# Altium schematic sheet ST Sensor Output Socket.SchDoc: Soil Temperature Sensor Output Socket
size A4; SheetNumber: 31; SheetTotal: 37
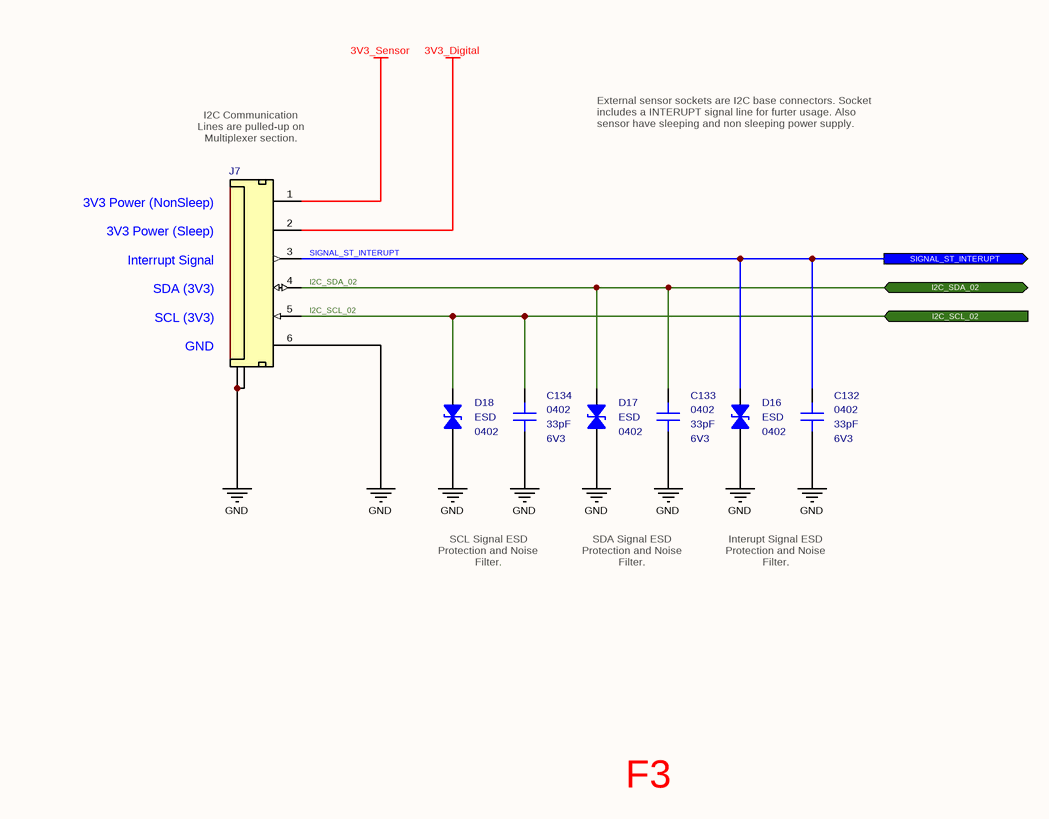
[diagram p0: ST Sensor Output Socket.SchDoc]

## Parts
C132  value 33pF  Case: 0402  Voltage: 6V3  [CAPACITOR_0402]  (hidden comment: Multilayer Ceramic Capacitor)
C133  value 33pF  Case: 0402  Voltage: 6V3  [CAPACITOR_0402]  (hidden comment: Multilayer Ceramic Capacitor)
C134  value 33pF  Case: 0402  Voltage: 6V3  [CAPACITOR_0402]  (hidden comment: Multilayer Ceramic Capacitor)
D16  Case: 0402  [ESD_0402]  (hidden comment: ESD Suppressors)
D17  Case: 0402  [ESD_0402]  (hidden comment: ESD Suppressors)
D18  Case: 0402  [ESD_0402]  (hidden comment: ESD Suppressors)
J7  ST Sensor Socket  [Connector_Tunic 6P - H]  (value not drawn)

## Ports
I2C_SCL_02 (in), I2C_SDA_02 (bidir), SIGNAL_ST_INTERUPT (out)

## Nets
3V3_Digital: J7.2(3V3_Digital)
3V3_Sensor: J7.1(3V3_Sensor)
GND: C132.1 C133.1 C134.1 D16.1 D17.1 D18.1 J7.6(GND) J7.7(Termination) J7.8(Termination)
I2C_SCL_02: C134.2 D18.2 J7.5(SCL02) ; port I2C_SCL_02
I2C_SDA_02: C133.2 D17.2 J7.4(SDA02) ; port I2C_SDA_02
SIGNAL_ST_INTERUPT: C132.2 D16.2 J7.3(ST_Interupt) ; port SIGNAL_ST_INTERUPT

## Notes on the sheet
- I2C Communication Lines are pulled-up on Multiplexer section.
- External sensor sockets are I2C base connectors. Socket includes a INTERUPT signal line for furter usage. Also sensor have sleeping and non sleeping power supply.
- (near J7) 3V3 Power (NonSleep)
  3V3 Power (Sleep)
  Interrupt Signal
  SDA (3V3)
  SCL (3V3)
  GND
- SCL Signal ESD Protection and Noise Filter.
- SDA Signal ESD Protection and Noise Filter.
- Interupt Signal ESD Protection and Noise Filter.
- F3
- Title
- Size:
- Date:
- A4
- Number:
- Time:
- Revision:
- Sheet
- of
- File:
- (in symbol Diode - ESD Protection) ESD

## Library data of the parts
C132-C134 = Capacitor - 33pF [0402-6V3]: Capacitor - 33pF [0402] (Ceramic); Manufacturer_Name: Kemet; Manufacturer_Part_Number: C0402C330J9RACAUTO; Dielectric: X7R; Tolerance: 10%; Height: 0.5mm; Mouser_Part_Number: 80-C0402C330J9RAUTO; Maximum Operating Temperature: +125; Minimum Operating Temperature: -55; ROHS: Yes; ComponentLink1Description: DataSheet; ComponentLink1URL: https://api.kemet.com/component-edge/download/datasheet/C0402C330J9RACAUTO.pdf; ComponentLink2Description: Mouser; ComponentLink2URL: https://www.mouser.com/Search/Refine.aspx?Keyword=80-C0402C330J9RAUTO; Supplier 1: Mouser; Supplier Part Number 1: 80-C0402C330J9RAUTO
D16-D18 = Diode - ESD Protection: TVS Diode (Bi-directional); Manufacturer_Name: Bussmann / Eaton; Manufacturer_Part_Number: 0402ESDA-MLP1; Clamping Voltage: 35V; Diode Capacitance: 0.05pF; Polarity: Bidirectional; Voltage ESD Air Gap: 15kV; Voltage ESD Contact: 8kV; Working Voltage: 30V; Height: 0.436mm; Mouser_Part_Number: 504-0402ESDA-MLP1; Maximum Operating Temperature: +125; Minimum Operating Temperature: -55; ROHS: Yes; ComponentLink1Description: DataSheet; ComponentLink1URL: https://www.mouser.com.tr/datasheet/2/87/47c59e11-d058-4882-bc35-d8572f2ca054-38826.pdf; ComponentLink2Description: Mouser; ComponentLink2URL: https://www.mouser.com.tr/ProductDetail/Bussmann-Eaton/0402ESDA-MLP1?qs=%2Fha2pyFadughxyc7TyLWeW%2FUvipVY6Ex3naV%2FjpO3plZBZWDLqV4bw%3D%3D; Supplier 1: Mouser; Supplier 2: Digi-Key; Supplier Part Number 2: 283-2964-1-ND; Supplier Part Number 1: 504-0402ESDA-MLP1
J7 = Connector - Mini Tunic 6P (1.25): Mini Tunic Connector with 6P; Manufacturer_Name: Molex; Manufacturer_Part_Number: 53261-0671; ROHS: Yes; Supplier 1: Avnet; Supplier 2: Mouser; Supplier 3: Arrow; Supplier 4: Farnell; Supplier 5: Newark; Supplier 6: Digi-Key; Supplier Part Number 1: 0532610671; Supplier Part Number 2: 538-53261-0671; Supplier Part Number 3: 53261-0671; Supplier Part Number 4: 1125375; Supplier Part Number 5: 93K4246; Supplier Part Number 6: WM7624CT-ND; System: Connector